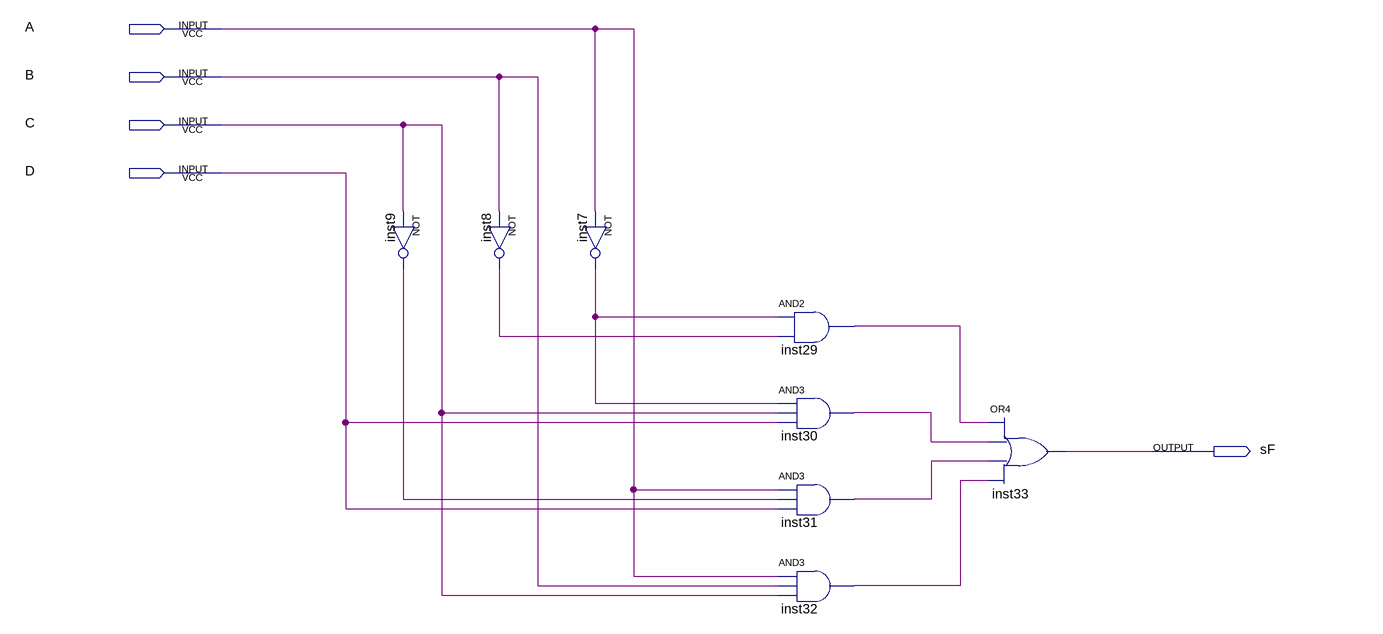
[diagram p0: schematic sheet]
// Quartus schematic decodificadorParcelaSaidaF.bdf as structural Verilog: 8 symbols, 5 pins
module decodificadorParcelaSaidaF (
  input  A,
  input  B,
  input  C,
  input  D,
  output sF
);

  wire inst7_out, inst8_out, inst9_out, inst29_out, inst30_out, inst31_out, inst32_out;

  not inst9 (inst9_out, C);
  not inst8 (inst8_out, B);
  not inst7 (inst7_out, A);
  and inst29 (inst29_out, inst7_out, inst8_out);
  and inst30 (inst30_out, inst7_out, C, D);
  and inst31 (inst31_out, A, inst9_out, D);
  and inst32 (inst32_out, A, B, C);
  or inst33 (sF, inst29_out, inst30_out, inst31_out, inst32_out);
endmodule
